# EAGLE design Arduino-4 Relays-Shield-V1 (EAGLE 6.4)
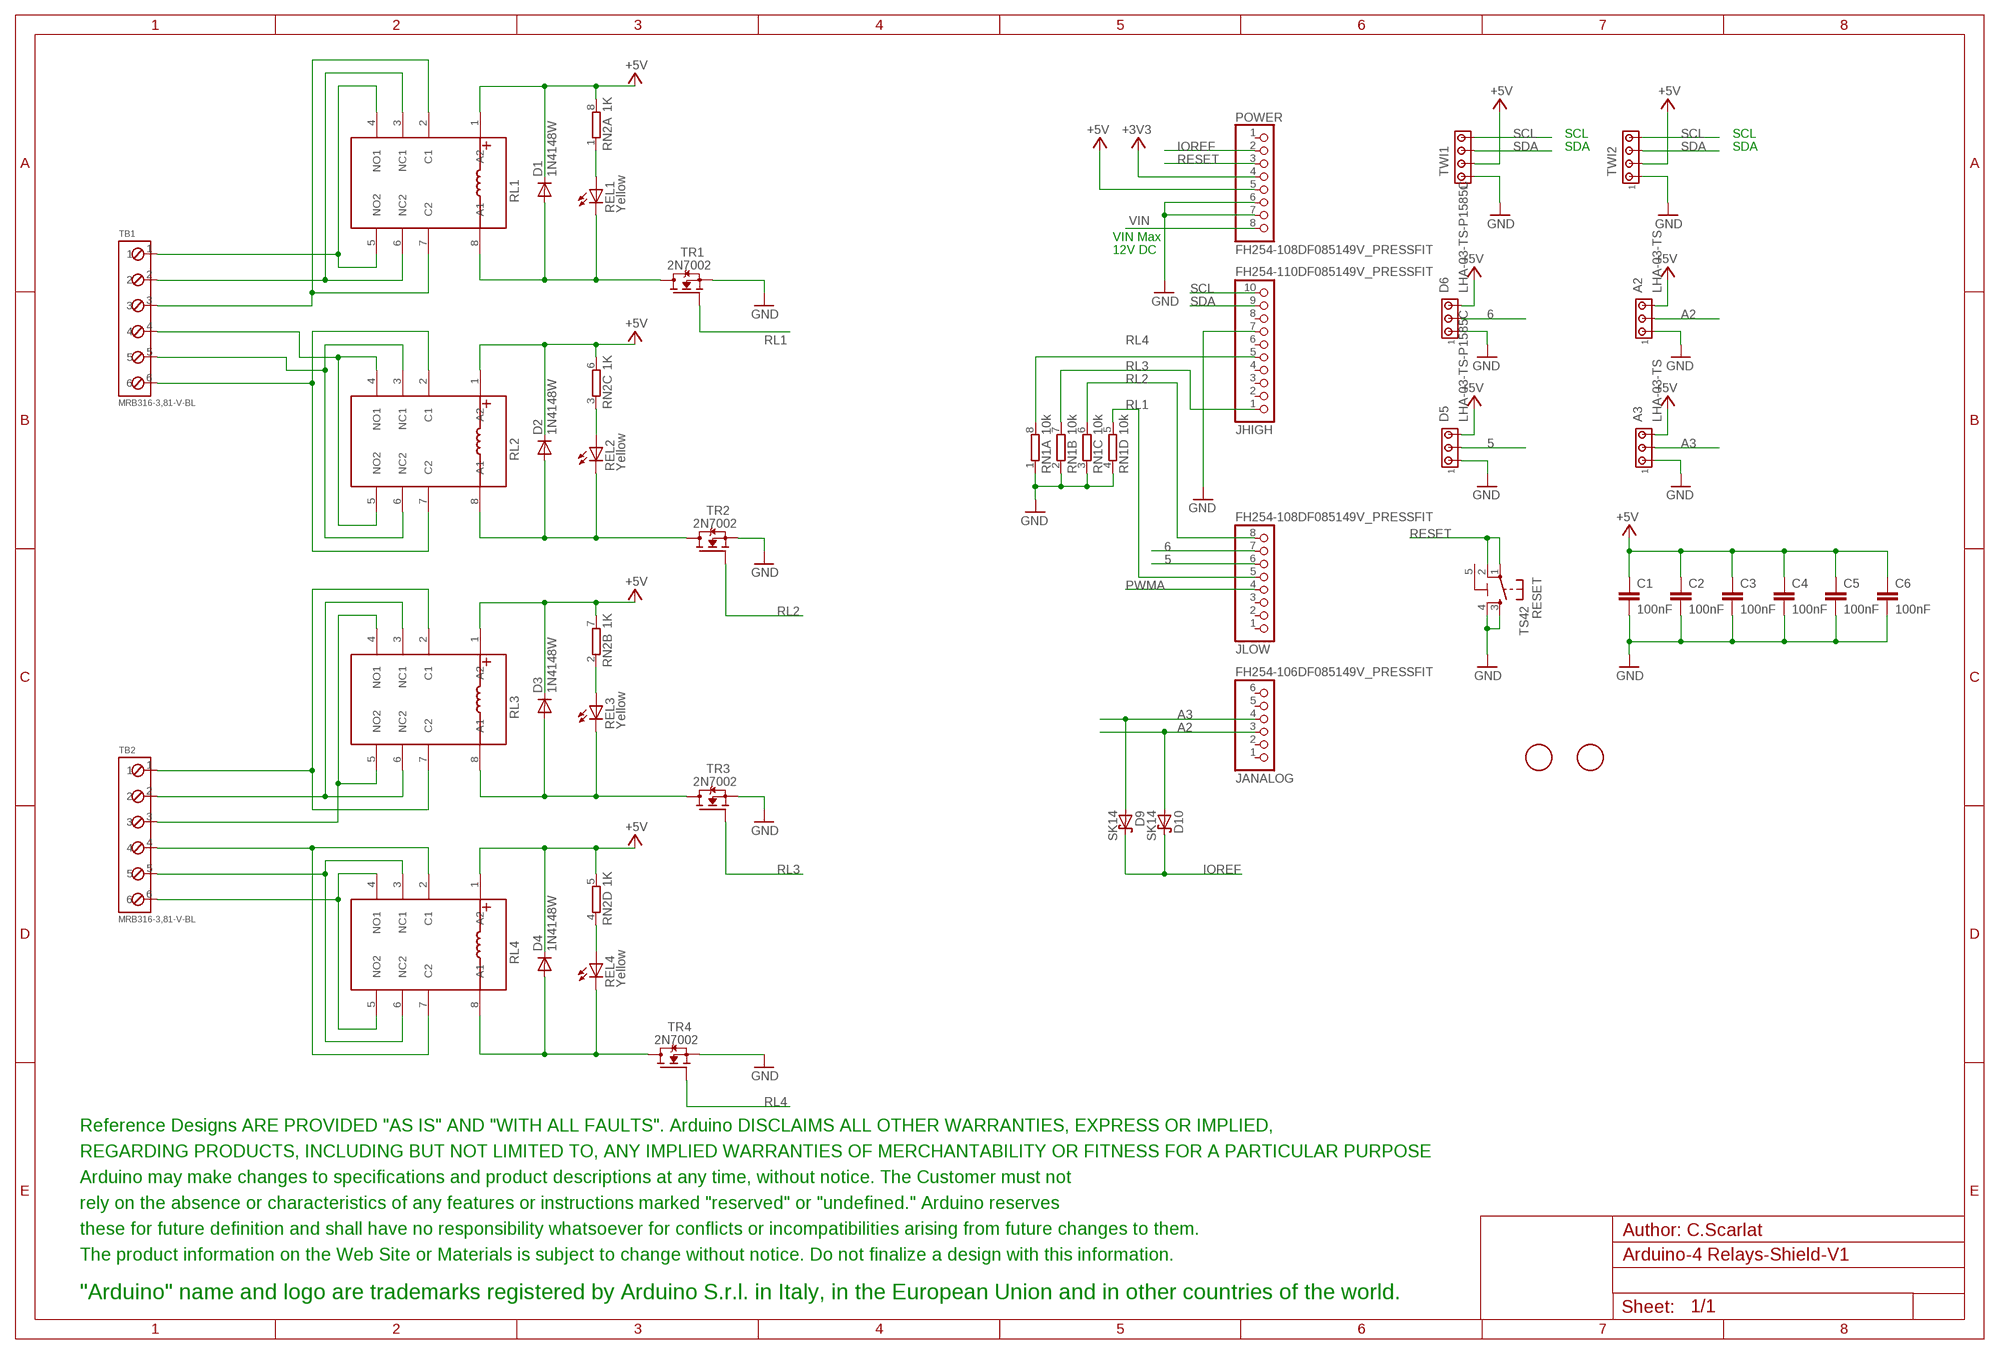
[diagram p0: schematic, sheet 1]

## Parts
A2  LHA-03-TS  0141_LHA-03-TS  [10X03MTA]
A3  LHA-03-TS  0141_LHA-03-TS  [10X03MTA]
C1  100nF  0015_100NF_0603  [C0603-ROUND]
C2  100nF  0015_100NF_0603  [C0603-ROUND]
C3  100nF  0015_100NF_0603  [C0603-ROUND]
C4  100nF  0015_100NF_0603  [C0603-ROUND]
C5  100nF  0015_100NF_0603  [C0603-ROUND]
C6  100nF  0015_100NF_0603  [C0603-ROUND]
D1  1N4148W  0290_1N4148W  [SOD123]
D2  1N4148W  0290_1N4148W  [SOD123]
D3  1N4148W  0290_1N4148W  [SOD123]
D4  1N4148W  0290_1N4148W  [SOD123]
D5  LHA-03-TS-P1585C  0481_LHA-03-TS-P1585C  [10X03MTA]
D6  LHA-03-TS-P1585C  0481_LHA-03-TS-P1585C  [10X03MTA]
D9  SK14  0234_SK14  [SMB]
D10  SK14  0234_SK14  [SMB]
FID2  FIDUCIALMOUNT  [FIDUCIA-MOUNT]
FID3  FIDUCIALMOUNT  [FIDUCIA-MOUNT]
JANALOG  FH254-106DF085149V_PRESSFIT  0061_FH254-106DF085149VPRESSFIT  [1X06-TH-PRESSFIT]
JHIGH  FH254-110DF085149V_PRESSFIT  0063_FH254-110DF085149VPRESSFIT  [1X10-TH-PRESSFIT]
JLOW  FH254-108DF085149V_PRESSFIT  0062_FH254-108DF085149VPRESSFIT  [1X08-TH-PRESSFIT]
POWER  FH254-108DF085149V_PRESSFIT  0062_FH254-108DF085149VPRESSFIT  [1X08-TH-PRESSFIT]
REL1  Yellow  0044_KPT-2012YC  [CHIPLED_0805]
REL2  Yellow  0044_KPT-2012YC  [CHIPLED_0805]
REL3  Yellow  0044_KPT-2012YC  [CHIPLED_0805]
REL4  Yellow  0044_KPT-2012YC  [CHIPLED_0805]
RESET  TS42  0946_TS42031-160W-TR-7260  [TS42]
RL1  1045_G5V-2-H1  [RELE'-30SSERIES-DIL-2X]
RL2  1045_G5V-2-H1  [RELE'-30SSERIES-DIL-2X]
RL3  1045_G5V-2-H1  [RELE'-30SSERIES-DIL-2X]
RL4  1045_G5V-2-H1  [RELE'-30SSERIES-DIL-2X]
RN1  10k  0016_064R_10K_/_CAY16-103J4LF  [CAY16]
RN2  1K  0005_064R_1K_/_CAY16-102J4LF  [CAY16]
TB1  MRB316-3,81-V-BL  0698_MRB316-3,81-V-BL  [MRB316-3,81-V-BL]
TB2  MRB316-3,81-V-BL  0698_MRB316-3,81-V-BL  [MRB316-3,81-V-BL]
TR1  2N7002  1612_2N7002LT1G  [SOT-23]
TR2  2N7002  1612_2N7002LT1G  [SOT-23]
TR3  2N7002  1612_2N7002LT1G  [SOT-23]
TR4  2N7002  1612_2N7002LT1G  [SOT-23]
TWI1  0205_LHA-04-TS__4X1_VERTICALE_BIANCO_P_2,54  [10X04MTA]
TWI2  0205_LHA-04-TS__4X1_VERTICALE_BIANCO_P_2,54  [10X04MTA]
U$2  DISCLAIMER-SMALL  [DISCLAIMER]

## Nets
5: D5.2 JLOW.6
6: D6.2 JLOW.7
+3V3 [power]: POWER.4
+5V [power]: A2.3 A3.3 C1.1 C2.1 C3.1 C4.1 C5.1 C6.1 D1.C D2.C D3.C D4.C D5.3 D6.3 POWER.5 RL1.1(A2) RL2.1(A2) RL3.1(A2) RL4.1(A2) RN2.5 RN2.6 RN2.7 RN2.8 TWI1.2 TWI2.2
A2: A2.2 D10.A JANALOG.3
A3: A3.2 D9.A JANALOG.4
GND [power]: A2.1 A3.1 C1.2 C2.2 C3.2 C4.2 C5.2 C6.2 D5.1 D6.1 JHIGH.7 POWER.6 POWER.7 RESET.3 RESET.4 RN1.1 RN1.2 RN1.3 RN1.4 TR1.2(S) TR2.2(S) TR3.2(S) TR4.2(S) TWI1.1 TWI2.1
IOREF: D9.C D10.C POWER.2
N$1: REL1.A RN2.1
N$2: REL2.A RN2.3
N$3: REL3.A RN2.2
N$4: REL4.A RN2.4
N$14: D1.A REL1.C RL1.8(A1) TR1.1(D)
N$16: D2.A REL2.C RL2.8(A1) TR2.1(D)
N$18: D3.A REL3.C RL3.8(A1) TR3.1(D)
N$20: D4.A REL4.C RL4.8(A1) TR4.1(D)
PWMA: JLOW.4
REL1_COM [RelayOut]: RL1.2(C1) RL1.7(C2) TB1.3
REL1_NC [RelayOut]: RL1.3(NC1) RL1.6(NC2) TB1.2
REL1_NO [RelayOut]: RL1.4(NO1) RL1.5(NO2) TB1.1
REL2_COM [RelayOut]: RL2.2(C1) RL2.7(C2) TB1.6
REL2_NC [RelayOut]: RL2.3(NC1) RL2.6(NC2) TB1.5
REL2_NO [RelayOut]: RL2.4(NO1) RL2.5(NO2) TB1.4
REL3_COM [RelayOut]: RL3.2(C1) RL3.7(C2) TB2.1
REL3_NC [RelayOut]: RL3.3(NC1) RL3.6(NC2) TB2.2
REL3_NO [RelayOut]: RL3.4(NO1) RL3.5(NO2) TB2.3
REL4_COM [RelayOut]: RL4.2(C1) RL4.7(C2) TB2.4
REL4_NC [RelayOut]: RL4.3(NC1) RL4.6(NC2) TB2.5
REL4_NO [RelayOut]: RL4.4(NO1) RL4.5(NO2) TB2.6
RESET: POWER.3 RESET.1 RESET.2
RL1: JLOW.5 RN1.5 TR1.3(G)
RL2: JLOW.8 RN1.6 TR2.3(G)
RL3: JHIGH.1 RN1.7 TR3.3(G)
RL4: JHIGH.5 RN1.8 TR4.3(G)
SCL: JHIGH.10 TWI1.4 TWI2.4
SDA: JHIGH.9 TWI1.3 TWI2.3
VIN [VIN]: POWER.8
Unconnected: JANALOG.1 JANALOG.2 JANALOG.5 JANALOG.6 JHIGH.2 JHIGH.3 JHIGH.4 JHIGH.6 JHIGH.8 JLOW.1 JLOW.2 JLOW.3 POWER.1

## Notes on the sheet
- SCL | SCL
- SDA | SDA
- VIN Max
- 12V DC
- Author: C.Scarlat

## Power pins joined to a net without a drawn wire
5-GND: RESET.5(5-GND)

## Library data of the parts
A2 A3 = Connettori:0141_LHA-03-TS: 3x1 V Bianco P2,54; MONTHLY_USAGE: _____; PART_NUMBER: LHA-03-TS; PRICE: _____; SUPPLIER: _____; TYPE: Connettori
C1-C6 = Condensatori:0015_100NF_0603: 100nF 0603 50V; CASE: 0603; MONTHLY_USAGE: _____; PART_NUMBER: cl10b104kbnc; PRICE: _____; SUPPLIER: _____; TYPE: Condensatori
D1-D4 = Diodi:0290_1N4148W: FAST SMALL SIGNAL DIODES SMD 200mA 100V SOD123; CASE: SOD123; MONTHLY_USAGE: _____; PART_NUMBER: 1N4148W; PRICE: _____; SUPPLIER: _____; TYPE: Diodi
D5 D6 = Connettori:0481_LHA-03-TS-P1585C: 3x1 Poli V Arancioni; MONTHLY_USAGE: _____; PART_NUMBER: LHA-03-TS-P1585C; PRICE: _____; SUPPLIER: _____; TYPE: Connettori
D9 D10 = Diodi:0234_SK14: SURFACE MOUNT SCHOTTKY BARRIER RECTIFIER SK14; CASE: SMB; MONTHLY_USAGE: _____; PART_NUMBER: SK14; PRICE: _____; SUPPLIER: _____; TYPE: Diodi
FID2 FID3 = SmartPrj:FIDUCIALMOUNT
JANALOG = Connettori:0061_FH254-106DF085149V: Female Connector strip for Arduino Shields - 6x1 F V h 14,9 P2,54; PART_NUMBER: FH254-106DF085149V; TYPE: Connettori
JHIGH = Connettori:0063_FH254-110DF085149V: Female Connector strip for Arduino Shields - 10x1 F V h 14,9 P2,54; PART_NUMBER: FH254-110DF085149V; TYPE: Connettori
JLOW POWER = Connettori:0062_FH254-108DF085149V: Female Connector strip for Arduino Shields - 8x1 F V h 14,9 P2,54; PART_NUMBER: FH254-108DF085149V; TYPE: Connettori
REL1-REL4 = Opto:0044_KPT-2012YC: LED YELLOW - SMD - 0805; MONTHLY_USAGE: _____; PART_NUMBER: KPT-2012YC; PRICE: _____; SUPPLIER: _____; TYPE: Opto
RESET = Switches:0946_TS42031-160W-TR-7260: Pushbutton 6x6 Smd - White; MONTHLY_USAGE: _____; PART_NUMBER: IT-1157AHNP-160G-G_GTR; PRICE: _____; SUPPLIER: _____; TYPE: Switches
RL1-RL4 = Rele':1045_G5V-2-H1: Rel� 5V nero Omron; MONTHLY_USAGE: _____; PART_NUMBER: G5V-2-H1; PRICE: _____; SUPPLIER: _____; TYPE: Rele'; VALUE: G5V-2-H1
RN1 = Resistenze:0016_064R_10K_/_CAY16-103J4LF: 10K 064 R; CASE: SMD_3,2x1,6; MONTHLY_USAGE: _____; PART_NUMBER: 064R_10K_/_CAY16-103J4LF; PRICE: _____; SUPPLIER: _____; TYPE: Resistenze
RN2 = Resistenze:0005_064R_1K_/_CAY16-102J4LF: 1K 064R; CASE: SMD_3,2x1,6; MONTHLY_USAGE: _____; PART_NUMBER: 064R_1K_/_CAY16-102J4LF; PRICE: _____; SUPPLIER: _____; TYPE: Resistenze
TB1 TB2 = Morsettiere:0698_MRB316-3,81-V-BL: Morsetto 6 poli h8,5mm Blue - EURO-BLOCK; PART_NUMBER: MRB316-3,81-V-BL
TR1-TR4 = Transistors:1612_2N7002LT1G: 2N7002 60 V, 300 mA N-channel Trench MOSFET
TWI1 TWI2 = Connettori:0205_LHA-04-TS__4X1_VERTICALE_BIANCO_P_2,54: 4x1 V Bianco p 2,54; MONTHLY_USAGE: _____; PART_NUMBER: LHA-04-TS__4x1_Verticale_Bianco_p_2,54; PRICE: _____; SUPPLIER: _____; TYPE: Connettori
U$2 = Misc:DISCLAIMER-SMALL: DISCLAIMER

## Net classes
0 default: width 0.254 mm, drill 0.61 mm, clearance 0.152 mm
1 power: width 0.305 mm, drill 0.61 mm, clearance 0.305 mm
2 VIN: width 0.305 mm, drill 0.61 mm, clearance 0.152 mm
3 RelayOut: width 1.27 mm, clearance 4 mm to class 0, clearance 4 mm to class 1, clearance 4 mm to class 2, clearance 1.27 mm

## Board
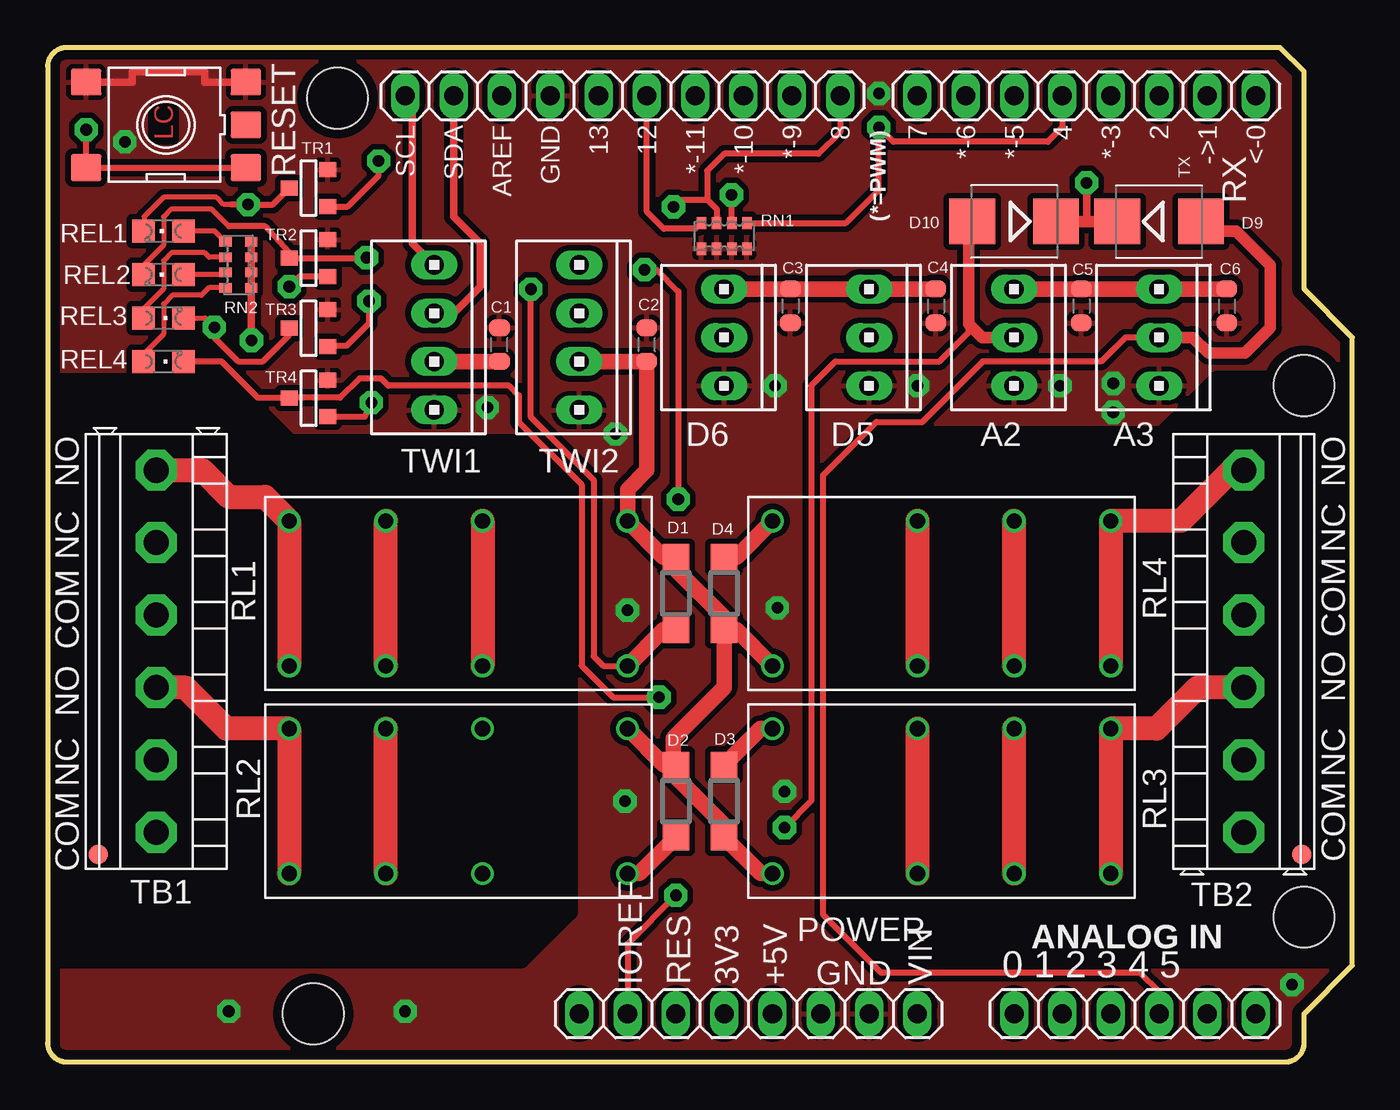
[diagram p1: board, top side]
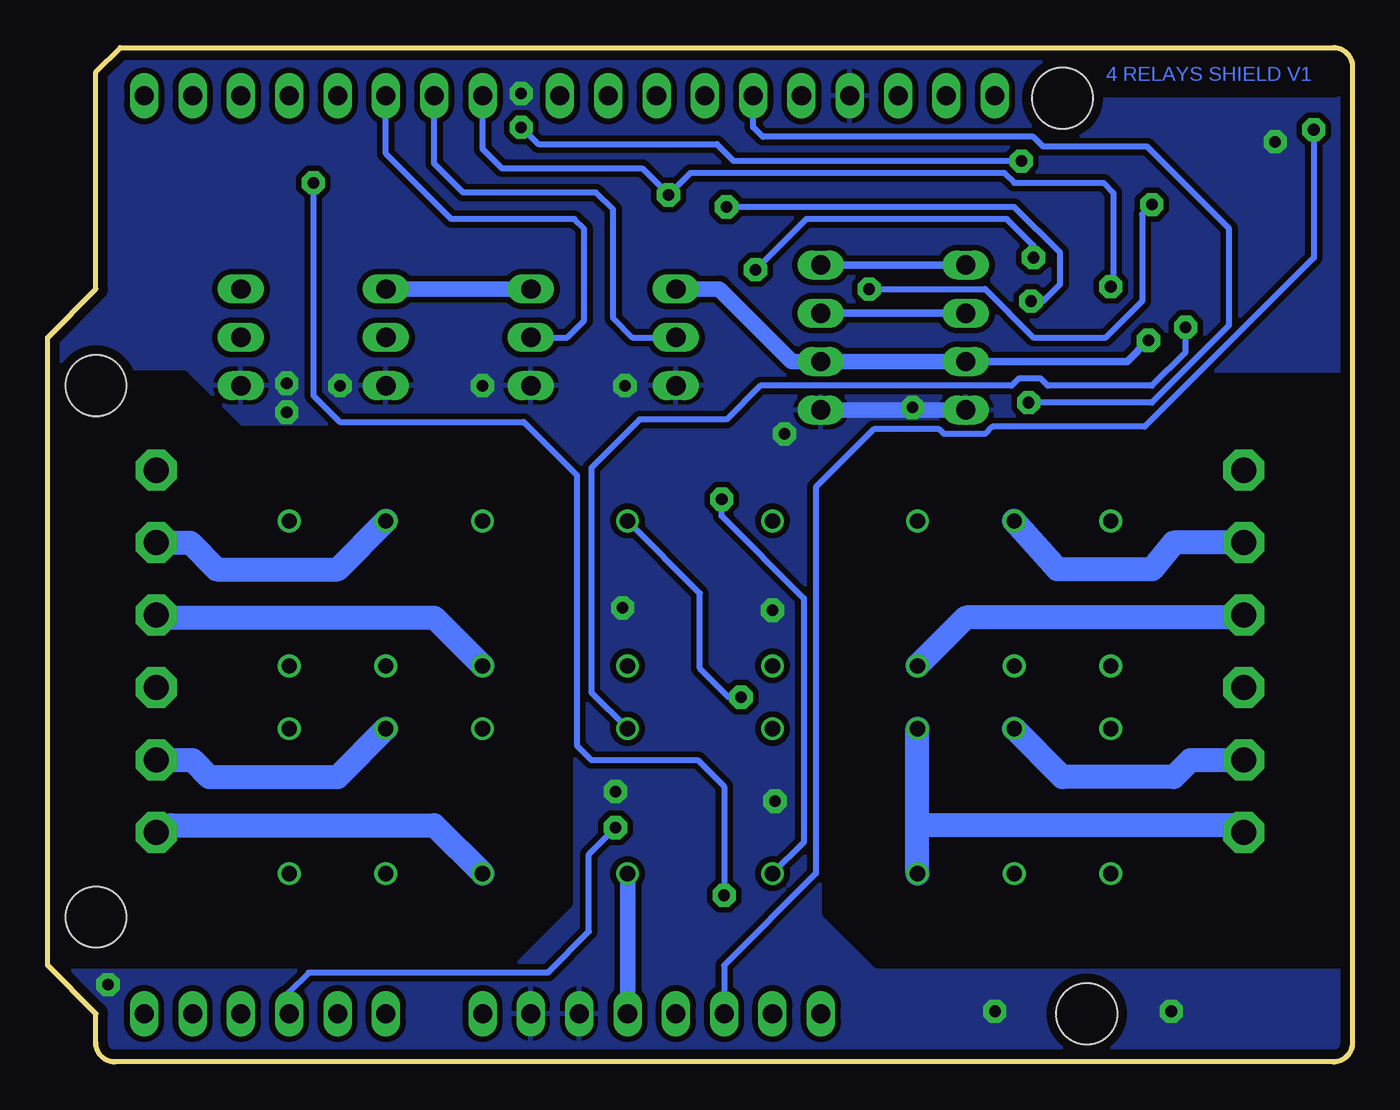
[diagram p2: board, bottom side, seen from below]

Size 68.58 x 53.34 mm. Coordinates in mm from the lower left corner, seen from the top.
Outline: 66.04,2.54 68.58,5.08 68.58,38.1 66.04,40.64 66.04,52.07 64.77,53.34 1,53.34 arc90 0,52.34 0,1 arc90 1,0 65.04,0 arc90 66.04,1 66.04,2.54
Copper layers (1*16): Top 0.035mm / dielectric 1.5mm / Bottom 0.035mm
Design rules "default *": minimum track width 10mil, minimum drill 10mil, track to track 12mil, track to pad 12mil, pad to pad 12mil, via to via 12mil, smd to smd 12mil, copper to edge 20mil, drill to drill 10mil, minimum pad ring 6mil, minimum via ring 12mil, stop-mask expansion 2mil, vias tented up to drill 32mil, thermal gap 10mil
Holes 3.2 mm at 66.04,35.56 66.04,7.62 15.24,50.67 13.97,2.54
tRestrict: 18 lines
bRestrict: 21 lines

### Footprints (pad centres in the part's own frame; a part is rotated, then mirrored left to right if it is on the bottom)
10X03MTA = drill 1.016 long: 1 2.54,0; 2 0,0; 3 -2.54,0
C0603-ROUND = smd 0.898 x 1.1: 1 -0.889,0; 2 0.889,0
SOD123 = smd 1.4 x 1.4: A 1.9,0; C -1.9,0
SMB = smd 2.4 x 2.4: A 2.2,0; C -2.2,0
FIDUCIA-MOUNT = smd 1.016 x 1.016: P$1 0,0
1X06-TH-PRESSFIT = drill 1 pad 1.422 long: 1 -6.35,0; 2 -3.81,0; 3 -1.27,0; 4 1.27,0; 5 3.81,0; 6 6.35,0
1X10-TH-PRESSFIT = drill 1 pad 1.422 long: 1 -11.43,0; 2 -8.89,0; 3 -6.35,0; 4 -3.81,0; 5 -1.27,0; 6 1.27,0; 7 3.81,0; 8 6.35,0; 9 8.89,0; 10 11.43,0
1X08-TH-PRESSFIT = drill 1 pad 1.422 long: 1 -8.89,0; 2 -6.35,0; 3 -3.81,0; 4 -1.27,0; 5 1.27,0; 6 3.81,0; 7 6.35,0; 8 8.89,0
CHIPLED_0805 = smd 1.2 x 1.2: A 0,-1.05; C 0,1.05
TS42 = smd 1.6 x 1.4: 1 -4.2,2.25; 2 4.2,2.25; 3 -4.2,-2.25; 4 4.2,-2.25; 5 -4.2,0
RELE'-30SSERIES-DIL-2X = drill 0.8: 1 -7.62,-3.81; 2 0,-3.81; 3 5.08,-3.81; 4 10.16,-3.81; 5 10.16,3.81; 6 5.08,3.81; 7 0,3.81; 8 -7.62,3.81
CAY16 = smd 0.5 x 0.65: 1 -1.2,-0.675; 2 -0.4,-0.675; 3 0.4,-0.675; 4 1.2,-0.675; 5 1.2,0.675; 6 0.4,0.675; 7 -0.4,0.675; 8 -1.2,0.675
MRB316-3,81-V-BL = drill 1.321 pad 2.159 octagon: 1 0,9.525; 2 0,5.715; 3 0,1.905; 4 0,-1.905; 5 0,-5.715; 6 0,-9.525
SOT-23 = smd 0.787 x 0.889: 1 0.025,-1.016; 2 -0.94,1.016; 3 0.991,1.016
10X04MTA = drill 1.016 long: 1 3.81,0; 2 1.27,0; 3 -1.27,0; 4 -3.81,0

### Placement (x,y rotation side)
A2  50.8,38.1 270 top
A3  58.42,38.1 270 top
C1  23.75,37.72 90 top
C2  31.5,37.72 90 top
C3  39.04,39.75 270 top
C4  46.69,39.75 270 top
C5  54.33,39.75 270 top
C6  61.98,39.75 270 top
D1  33.02,24.64 270 top
D2  33.02,13.72 270 top
D3  35.56,13.72 90 top
D4  35.56,24.64 90 top
D5  43.18,38.1 270 top
D6  35.56,38.1 270 top
D9  58.42,44.2 0 top
D10  50.8,44.2 180 top
FID2  2.67,10.92 0 top
FID3  65.91,10.92 0 top
JANALOG  57.15,2.54 0 top
JHIGH  30.23,50.8 180 top
JLOW  54.61,50.8 180 top
POWER  36.83,2.54 0 top
REL1  6.1,43.69 90 top
REL2  6.1,41.4 90 top
REL3  6.1,39.12 270 top
REL4  6.1,36.83 270 top
RESET  6.22,49.28 180 top
RL1  22.86,24.64 180 top
RL2  22.86,13.72 180 top
RL3  45.72,13.72 0 top
RL4  45.72,24.64 0 top
RN1  35.56,43.43 0 top
RN2  10.03,41.91 270 top
TB1  5.71,21.59 0 top
TB2  62.87,21.59 180 top
TR1  13.72,45.97 270 top
TR2  13.72,42.29 270 top
TR3  13.72,38.61 270 top
TR4  13.72,34.92 270 top
TWI1  20.32,38.1 270 top
TWI2  27.94,38.1 270 top
U$2  -6.48,-25.02 0 top  (outside the outline)

### Tracks (layer width: path | path; a pad name or v marks a point on that pad's centre or on a via)
5
  Bottom 0.305: D5.2 41.27,38.1 40.39,38.99 40.39,43.81 40.89,44.32 47.37,44.32 50.8,47.75 JLOW.6
6
  Bottom 0.305: D6.2 37.85,38.1 38.86,39.12 38.86,44.83 39.75,45.72 46.74,45.72 48.26,47.24 JLOW.7
+5V  (via drill 0.61)
  Top 0.406: v10.72,37.95 10.71,37.96 RN2.5 RN2.6 RN2.7 RN2.8
  Top 0.813: D6.3 C3.1 D5.3 C4.1 | A2.3 C5.1 A3.3 C6.1 | 29.59,36.83 TWI2.2 C2.1 31.5,31.11 30.48,30.1 RL1.1 32.39,26.54 D1.C 33.02,25.91 35.56,23.37 D4.C | C1.1 TWI1.2 | D4.C 36.19,22.74 RL4.1 | RL3.1 37.47,9.91 D3.C 35.56,12.45 33.02,14.99 D2.C | D2.C 32.39,15.62 RL2.1 | D4.C 35.56,19.68 32.89,17.02 32.89,15.74 D2.C
  Bottom 0.406: TWI1.2 11.84,36.83 v10.72,37.95
  Bottom 0.813: TWI1.2 TWI2.2 29.46,36.83 33.27,40.64 D6.3 | RL3.1 POWER.5 | A2.3 D5.3
A2  (via drill 0.61)
  Top 0.305: v38.73,12.32 40.13,13.72 40.13,35.56 41.4,36.83 46.86,36.83 48.41,38.38 48.41,39.12
  Top 0.61: A2.2 49.12,38.1 48.41,38.81 48.41,39.12 48.41,44.2 D10.A
  Bottom 0.305: v38.73,12.32 40.13,10.92 40.13,6.86 42.29,4.7 54.86,4.7 55.88,3.68 JANALOG.3
A3
  Top 0.305: A3.2 56.64,38.1 55.37,36.83 49.15,36.83 45.97,33.66 43.56,33.66 40.77,30.86 40.77,7.75 43.81,4.7 57.4,4.7 58.42,3.68 JANALOG.4
  Top 0.61: A3.2 60.2,38.1 61.04,37.26 62.92,37.26 64.26,38.61 64.26,41.91 62.48,43.69 61.13,43.69 D9.A
GND  (via drill 0.61)
  Top 0.406: RESET.4 4.45,51.53 4.45,52.07 8.26,52.07 8.26,51.53 RESET.3 | A2.1 50.29,35.56
  Bottom 0.813: TWI1.1 TWI2.1
  other vias: 43.69,50.93 65.41,4.06 38.73,14.22 18.8,2.67 4.06,48.39 9.53,2.67 23.11,34.42 29.84,33.02 38.23,35.56 45.72,35.56 53.21,35.56 56.01,35.69 56.01,34.16 30.48,23.75 38.35,23.88 30.35,13.72
  pour Bottom (isolate 0.305): -2.54,55.88 71.12,55.88 71.12,-2.54 -2.54,-2.54
  pour Top (isolate 0.305): -5.08,53.34 68.58,53.34 68.58,0 -5.08,0
IOREF  (via drill 0.61)
  Top 0.305: v33.02,8.76 30.48,6.22 POWER.2
  Top 0.406: v54.61,46.23 54.61,44.2
  Top 0.61: D10.C 54.1,44.2 54.61,44.2 D9.C
  Bottom 0.305: v54.61,46.23 54.61,35.05 53.21,33.66 43.56,33.66 40.77,30.86 40.77,16.64 40.01,15.88 34.42,15.88 33.02,14.48 v33.02,8.76
N$1
  Top 0.254: RN2.1 8.78,43.69 REL1.A
N$2
  Top 0.254: RN2.3 9.25,41.4 REL2.A
N$3
  Top 0.254: 5.21,39.15 REL3.A | RN2.2 8.49,42.31 8.26,42.55 6.5,42.55 6.1,42.14 6.1,40.66 5.05,39.62 REL3.A | 5.08,39.15 REL3.A
N$4
  Top 0.254: RN2.4 8.48,40.71 8.08,40.31 6.55,40.31 6.1,39.85 6.1,38.28 5.05,37.23 REL4.A
N$14  (via drill 0.61)
  Top 0.254: 9.65,45.09 9.27,45.09 8.89,45.47 6.1,45.47 5.08,44.45 5.08,43.42 REL1.C
  Top 0.305: TR1.1 11.84,45.09 v10.54,45.09 9.65,45.09 | v25.4,40.64 25.4,33.91 28.7,30.61 28.7,21.34 29.21,20.83 RL1.8
  Top 0.813: D1.A 32.39,22.74 RL1.8
  Bottom 0.305: v25.4,40.64 19.3,40.64 16.76,38.1 12.95,38.1 11.05,40.01 11.05,44.58 v10.54,45.09
N$16  (via drill 0.61)
  Top 0.254: 9.53,43.94 8.64,44.83 6.48,44.83 6.1,44.45 6.1,42.95 5.05,41.9 REL2.C
  Top 0.305: v31.37,41.66 32,41.66 33.15,40.51 v33.15,29.59 | v16.76,42.29 16.74,42.27 TR2.1 12.68,42.29 12.68,42.57 11.43,43.94 9.53,43.94
  Top 0.813: RL2.8 31.11,9.91 D2.A
  Bottom 0.305: v31.37,41.66 28.7,44.32 18.16,44.32 16.76,42.93 v16.76,42.29 | v33.15,29.59 33.15,28.7 28.83,24.38 28.83,11.56 RL2.8
N$18  (via drill 0.61)
  Top 0.254: REL3.C 8.28,39.12 v8.76,38.63
  Top 0.305: 12.68,38.61 TR3.1 12.7,38.23 11.3,36.83 10.03,36.83 8.76,38.1 v8.76,38.63
  Top 0.813: RL3.8 37.47,17.53 D3.A
  Bottom 0.305: RL3.8 40.01,19.43 40.01,31.24 37.47,33.78 32.89,33.78 31.11,35.56 17.91,35.56 17.53,35.94 16.38,35.94 16,35.56 10.54,35.56 8.76,37.34 v8.76,38.63
N$20  (via drill 0.61)
  Top 0.305: v32.13,19.18 29.72,19.18 28.07,20.83 28.07,30.35 24.77,33.66 24.77,35.05 24.26,35.56 17.91,35.56 17.53,35.94 16.38,35.94 15.37,34.92 12.72,34.92 TR4.1 12.68,34.92 11.05,34.92 9.14,36.83 REL4.C
  Top 0.813: D4.A 36.19,26.54 RL4.8
  Bottom 0.305: RL4.8 34.29,24.64 34.29,20.7 32.77,19.18 v32.13,19.18
REL1_COM
  Top 1.27: RL1.2 RL1.7
  Bottom 1.27: TB1.3 5.84,23.37 20.32,23.37 RL1.7
REL1_NC
  Top 1.27: RL1.6 RL1.3
  Bottom 1.27: TB1.2 9.4,27.3 10.54,25.91 15.49,25.91 RL1.3
REL1_NO
  Top 1.27: RL1.5 RL1.4 11.43,29.72 9.53,29.72 8.13,31.11 TB1.1
REL2_COM
  Bottom 1.27: RL2.7 22.86,12.45 | 22.86,12.45 RL2.2 | 22.86,12.45 6.1,12.45 TB1.6
REL2_NC
  Top 1.27: RL2.6 RL2.3
  Bottom 1.27: TB1.5 8.51,15.88 9.4,14.99 15.24,14.99 RL2.3
REL2_NO
  Top 1.27: RL2.5 RL2.4 9.4,17.53 7.24,19.68 TB1.4
REL3_COM
  Top 1.27: RL3.7 RL3.2
  Bottom 1.27: TB2.1 62.48,12.06 62.1,12.45 48.26,12.45 RL3.2
REL3_NC
  Top 1.27: RL3.3 RL3.6
  Bottom 1.27: TB2.2 60.96,15.88 60.07,14.99 53.34,14.99 RL3.6
REL3_NO
  Top 1.27: TB2.3 60.45,19.68 58.29,17.53 RL3.5 RL3.4
REL4_COM
  Top 1.27: RL4.7 RL4.2
  Bottom 1.27: RL4.2 48.26,23.37 62.74,23.37 TB2.4
REL4_NC
  Top 1.27: RL4.3 RL4.6
  Bottom 1.27: TB2.5 61.09,27.3 59.69,25.91 53.34,25.91 RL4.6
REL4_NO
  Top 1.27: TB2.6 62.23,31.11 59.56,28.45 RL4.5 RL4.4
RESET  (via drill 0.61)
  Top 0.305: v2.03,49.02 v2.02,49.01 RESET.2 RESET.1
  Bottom 0.305: v2.03,49.02 2.03,42.29 10.92,33.4 18.92,33.4 19.3,33.02 21.46,33.02 21.72,33.27 25.15,33.27 28.19,30.23 28.19,9.91 33.02,5.08 POWER.3
RL1  (via drill 0.61)
  Top 0.305: TR1.3 15.77,44.98 17.4,46.61 v17.4,47.37 | JLOW.5 53.34,49.15 52.58,48.39 44.45,48.39 v43.69,49.15 43.69,45.85 41.95,44.11 RN1.5
  Bottom 0.305: v17.4,47.37 32.51,47.37 33.4,48.26 42.8,48.26 v43.69,49.15
RL2  (via drill 0.61)
  Top 0.305: RN1.6 35.96,45.57 v35.94,45.59 | TR2.3 13.23,41.3 v12.7,40.77
  Bottom 0.305: v12.7,40.77 12.57,40.89 12.57,45.72 13.08,46.23 17.78,46.23 18.29,46.74 34.8,46.74 v35.94,45.59 37.34,46.99 44.7,46.99 45.72,48.01 JLOW.8
RL3  (via drill 0.61)
  Top 0.305: v16.89,40.01 16.89,38.84 15.7,37.64 14.76,37.64 TR3.3 | JHIGH.1 41.66,48.9 40.51,47.75 35.56,47.75 34.67,46.86 34.67,45.34 | 34.67,45.34 35.18,44.83 35.18,44.13 RN1.7 | v32.89,44.96 33.27,45.34 34.67,45.34
  Bottom 0.305: v16.89,40.01 16.26,40.01 15.37,40.89 15.37,42.55 17.78,44.96 v32.89,44.96
RL4  (via drill 0.61)
  Top 0.305: TR4.3 16.66,33.93 v17.02,34.67 | RN1.8 34.33,44.11 34.04,43.81 32.38,43.81 31.5,44.7 JHIGH.5
  Bottom 0.305: v17.02,34.67 10.54,34.67 6.48,38.73 6.48,43.81 10.79,48.13 16.26,48.13 16.76,48.64 30.99,48.64 31.5,49.15 JHIGH.5
SCL
  Top 0.406: JHIGH.10 19.18,50.42 19.18,43.05 TWI1.4
  Bottom 0.406: TWI1.4 TWI2.4
SDA
  Top 0.406: JHIGH.9 21.34,44.45 22.73,43.05 22.73,40.77 21.34,39.37 TWI1.3
  Bottom 0.406: TWI1.3 TWI2.3

### Text on the board
Top: LC
Bottom: 4 RELAYS SHIELD V1
tNames: SCL | SDA | AREF | GND | 13 | 12 | *-11 | *-10 | *-9 | 8 | 7 | *-6 | *-5 | 4 | *-3 | 2 | ->1 | <-0 | TX | RX | (*=PWM) | NO | NO | NC | NC | COM | COM | NO | NO | NC | NC | COM | COM | ANALOG IN | IOREF | RES | 3V3 | +5V | GND | VIN | 0 1 2 3 4 5